# Altium schematic sheet connector.SchDoc
size A4; DocumentNumber: 3; SheetNumber: 3; SheetTotal: 3
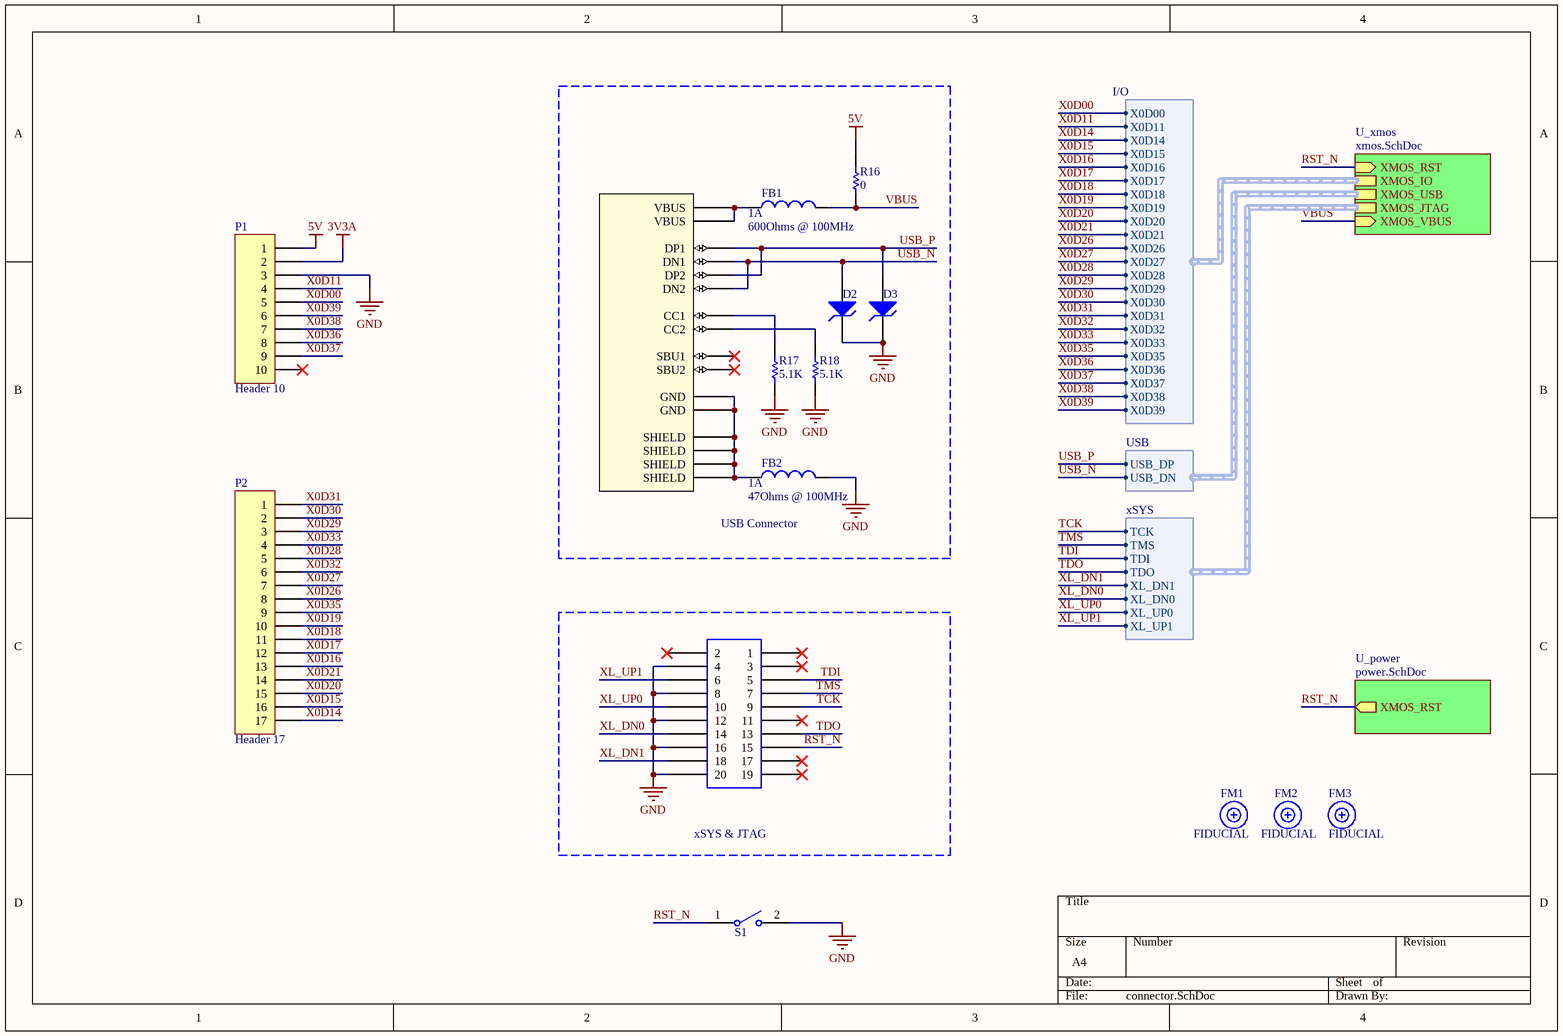
[diagram p0: connector.SchDoc]

## Parts
D2  ESD9B  [SOD-923-2]  (value not drawn)
D3  ESD9B  [SOD-923-2]  (value not drawn)
FB1  Impedance: 600Ohms @ 100MHz  MaximumDCCurrent: 1A  [IND_1608]  (hidden comment: Ferrite)
FB2  Impedance: 47Ohms @ 100MHz  MaximumDCCurrent: 1A  [IND_1608]  (hidden comment: Ferrite)
FM1  FIDUCIAL  [FIDUCIAL_10_20]
FM2  FIDUCIAL  [FIDUCIAL_10_20]
FM3  FIDUCIAL  [FIDUCIAL_10_20]
J1  USB C RECEPTACLE(1)  [USB C RECEPTACLE 2(1)]  (value not drawn)
J2  DC3-20P  [IDC-20 (1)]  (value not drawn)
P1  Header 10  [HDR1X10]
P2  Header 17  [HDR1X17]
R16  value 0  [RC0603N]  (hidden comment: RES)
R17  value 5.1K  [RC0603N]  (hidden comment: RES)
R18  value 5.1K  [RC0603N]  (hidden comment: RES)
S1  Tact Switch SPST  [TS_SPST_W4.2XD3.2]  (value not drawn)

## Blocks framed on the sheet
USB Connector: D2 D3 FB1 FB2 J1 R16-R18
xSYS & JTAG: J2

## Sub-sheets
U_power = power.SchDoc: XMOS_RST (out)
U_xmos = xmos.SchDoc: XMOS_IO (harness I/O), XMOS_JTAG (harness xSYS), XMOS_VBUS (in), XMOS_USB (harness USB), XMOS_RST (in)

## Harnesses
I/O: X0D00, X0D11, X0D14, X0D15, X0D16, X0D17, X0D18, X0D19, X0D20, X0D21, X0D26, X0D27, X0D28, X0D29, X0D30, X0D31, X0D32, X0D33, X0D35, X0D36, X0D37, X0D38, X0D39
xSYS: TCK, TMS, TDI, TDO, XL_DN1, XL_DN0, XL_UP0, XL_UP1
USB: USB_DP, USB_DN

## Nets
3V3A: P1.2
5V: P1.1 R16.2
GND: D2.2 D3.2 FB2.2 J2.4 J2.8 J2.12 J2.16 J2.20 P1.3 R17.1 R18.1 S1.2
RST_N: J2.15 S1.1 ; sheet U_power/XMOS_RST, sheet U_xmos/XMOS_RST
TCK: J2.9 ; sheet U_xmos/XMOS_JTAG.TCK
TDI: J2.5 ; sheet U_xmos/XMOS_JTAG.TDI
TDO: J2.13 ; sheet U_xmos/XMOS_JTAG.TDO
TMS: J2.7 ; sheet U_xmos/XMOS_JTAG.TMS
USB_N: D2.1 J1.A7(DN1) J1.B7(DN2) ; sheet U_xmos/XMOS_USB.USB_DN
USB_P: D3.1 J1.A6(DP1) J1.B6(DP2) ; sheet U_xmos/XMOS_USB.USB_DP
VBUS: FB1.2 R16.1 ; sheet U_xmos/XMOS_VBUS
X0D00: P1.5 ; sheet U_xmos/XMOS_IO.X0D00
X0D11: P1.4 ; sheet U_xmos/XMOS_IO.X0D11
X0D14: P2.17 ; sheet U_xmos/XMOS_IO.X0D14
X0D15: P2.16 ; sheet U_xmos/XMOS_IO.X0D15
X0D16: P2.13 ; sheet U_xmos/XMOS_IO.X0D16
X0D17: P2.12 ; sheet U_xmos/XMOS_IO.X0D17
X0D18: P2.11 ; sheet U_xmos/XMOS_IO.X0D18
X0D19: P2.10 ; sheet U_xmos/XMOS_IO.X0D19
X0D20: P2.15 ; sheet U_xmos/XMOS_IO.X0D20
X0D21: P2.14 ; sheet U_xmos/XMOS_IO.X0D21
X0D26: P2.8 ; sheet U_xmos/XMOS_IO.X0D26
X0D27: P2.7 ; sheet U_xmos/XMOS_IO.X0D27
X0D28: P2.5 ; sheet U_xmos/XMOS_IO.X0D28
X0D29: P2.3 ; sheet U_xmos/XMOS_IO.X0D29
X0D30: P2.2 ; sheet U_xmos/XMOS_IO.X0D30
X0D31: P2.1 ; sheet U_xmos/XMOS_IO.X0D31
X0D32: P2.6 ; sheet U_xmos/XMOS_IO.X0D32
X0D33: P2.4 ; sheet U_xmos/XMOS_IO.X0D33
X0D35: P2.9 ; sheet U_xmos/XMOS_IO.X0D35
X0D36: P1.8 ; sheet U_xmos/XMOS_IO.X0D36
X0D37: P1.9 ; sheet U_xmos/XMOS_IO.X0D37
X0D38: P1.7 ; sheet U_xmos/XMOS_IO.X0D38
X0D39: P1.6 ; sheet U_xmos/XMOS_IO.X0D39
XL_DN0: J2.14 ; sheet U_xmos/XMOS_JTAG.XL_DN0
XL_DN1: J2.18 ; sheet U_xmos/XMOS_JTAG.XL_DN1
XL_UP0: J2.10 ; sheet U_xmos/XMOS_JTAG.XL_UP0
XL_UP1: J2.6 ; sheet U_xmos/XMOS_JTAG.XL_UP1
NetFB1_1: FB1.1 J1.A4/B9(VBUS) J1.B4/A9(VBUS)
NetFB2_1: FB2.1 J1.A1/B12(GND) J1.B1/A12(GND) J1.SH1(SHIELD) J1.SH2(SHIELD) J1.SH3(SHIELD) J1.SH4(SHIELD)
NetJ1_A5: J1.A5(CC1) R17.2
NetJ1_B5: J1.B5(CC2) R18.2

Not connected (* = marked no-connect by the designer): J1 A8(SBU1)* B8(SBU2)*; J2 1* 2* 3* 11* 17* 19*; P1 10*

## Library data of the parts
D2 D3 = ESD9B: ESD Protection Diode; BreakdownVoltage: 5.8V; ClampingVoltage: 5V; VoltageESD: 18kV; PeakPulseCurrent: 1A; Capacitance: 15pF
FB1 FB2 = Ferrite: Ferrite Beads; Value: 10mH
FM1-FM3 = FIDUCIAL: Fiducial, dot
J1 = USB C RECEPTACLE(1): Universal Serial Bus (USB) I/O Receptacle, Type C, 2.0; Built_By: Gordon Mak
J2 = DC3-20P: 20-Pin Shrouded Header (IDC) Right Angle; Built_By: Gordon Mak
P1 = Header 10: Header, 10-Pin; LatestRevisionDate: 17-Jul-2002; LatestRevisionNote: Re-released for DXP Platform.; Publisher: Altium Limited
P2 = Header 17: Header, 17-Pin; LatestRevisionDate: 17-Jul-2002; LatestRevisionNote: Re-released for DXP Platform.; Publisher: Altium Limited
R16-R18 = RES: Chip Resistors; PowerRating: 0.25W
S1 = Tact Switch SPST: Switch